# EAGLE design TRC_power1.0.0 (EAGLE 9.6.2)
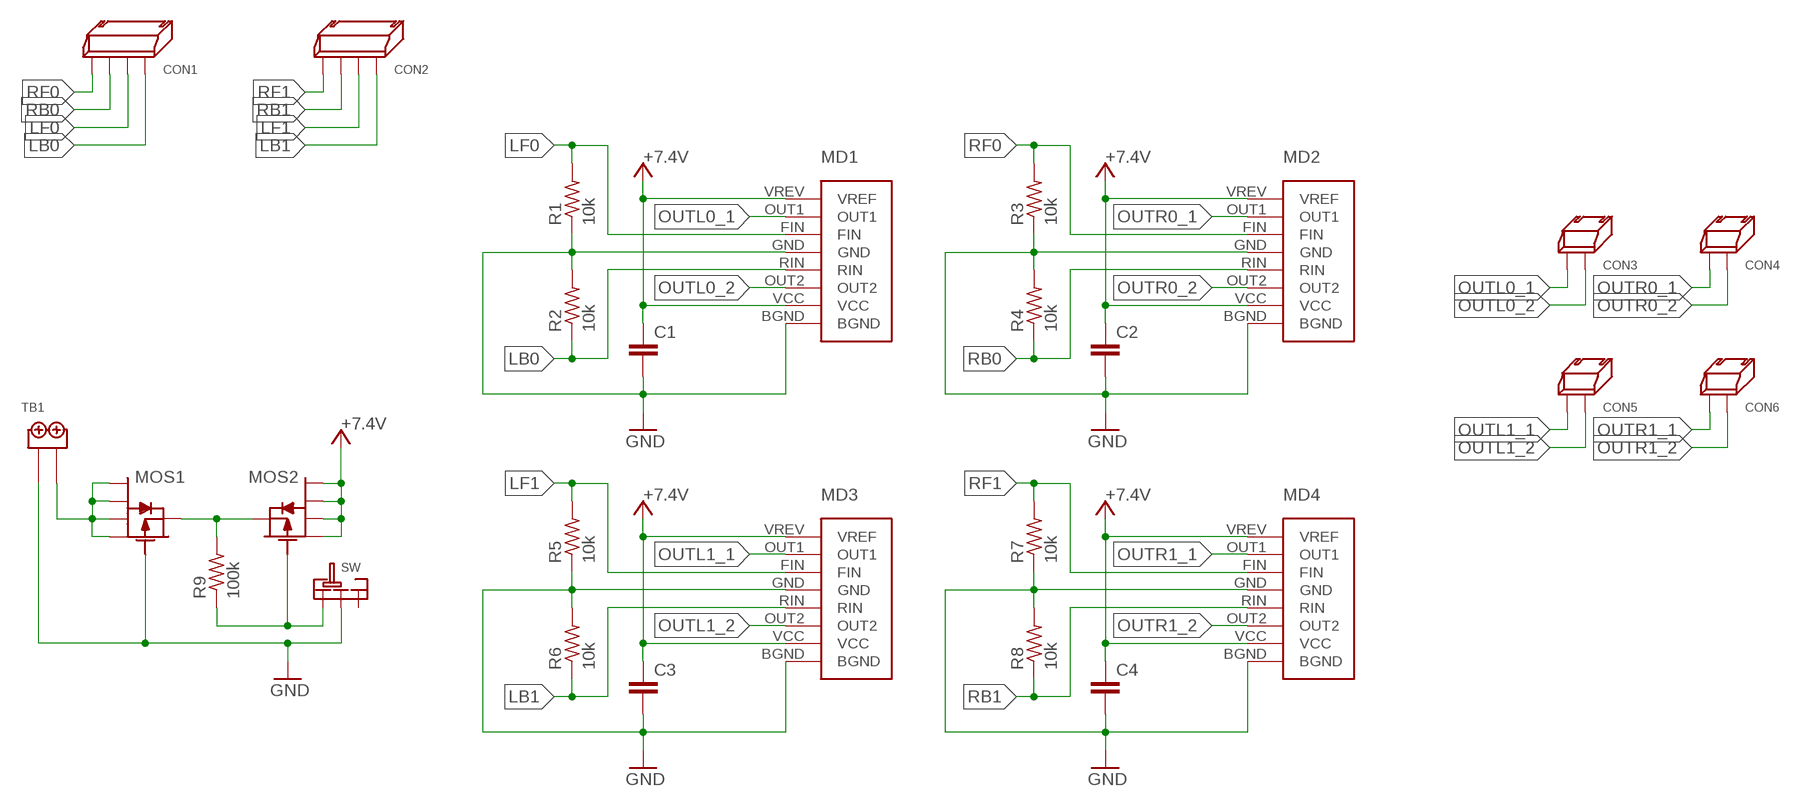
[diagram p0: schematic, sheet 1]

## Parts
C1  C-EUC0603  [C0603]
C2  C-EUC0603  [C0603]
C3  C-EUC0603  [C0603]
C4  C-EUC0603  [C0603]
CON1  4PIN_SIDE  [4PIN_SIDE]
CON2  4PIN_SIDE  [4PIN_SIDE]
CON3  2PIN_SIDE  [2PIN_SIDE]
CON4  2PIN_SIDE  [2PIN_SIDE]
CON5  2PIN_SIDE  [2PIN_SIDE]
CON6  2PIN_SIDE  [2PIN_SIDE]
MD1  BD6222HFP-TR  [BD6222HFP-TR]
MD2  BD6222HFP-TR  [BD6222HFP-TR]
MD3  BD6222HFP-TR  [BD6222HFP-TR]
MD4  BD6222HFP-TR  [BD6222HFP-TR]
MOS1  PCH_SSM6J808R  [SSM6J808R]
MOS2  PCH_SSM6J808R  [SSM6J808R]
R1  10k  R-US_R0603  [R0603]
R2  10k  R-US_R0603  [R0603]
R3  10k  R-US_R0603  [R0603]
R4  10k  R-US_R0603  [R0603]
R5  10k  R-US_R0603  [R0603]
R6  10k  R-US_R0603  [R0603]
R7  10k  R-US_R0603  [R0603]
R8  10k  R-US_R0603  [R0603]
R9  100k  R-US_R0603  [R0603]
SW  SRIDE_SWITCH  [SRIDE_SWITCH]
TB1  2PIN  [2PIN]

## Nets
+7.4V: C1.1 C2.1 C3.1 C4.1 MD1.VCC MD1.VREV(VREF) MD2.VCC MD2.VREV(VREF) MD3.VCC MD3.VREV(VREF) MD4.VCC MD4.VREV(VREF) MOS2.1 MOS2.2 MOS2.5 MOS2.6
GND: C1.2 C2.2 C3.2 C4.2 MD1.BGND MD1.GND MD2.BGND MD2.GND MD3.BGND MD3.GND MD4.BGND MD4.GND MOS1.3 R1.1 R2.2 R3.1 R4.2 R5.1 R6.2 R7.1 R8.2 SW.LR TB1.P$1
LB0: CON1.P$4 MD1.RIN R2.1
LB1: CON2.P$4 MD3.RIN R6.1
LF0: CON1.P$3 MD1.FIN R1.2
LF1: CON2.P$3 MD3.FIN R5.2
N$6: MOS1.4 MOS2.4 R9.2
N$7: MOS2.3 R9.1 SW.L
N$8: MOS1.1 MOS1.2 MOS1.5 MOS1.6 TB1.P$2
OUTL0_1: CON3.P$2 MD1.OUT1
OUTL0_2: CON3.P$1 MD1.OUT2
OUTL1_1: CON5.P$2 MD3.OUT1
OUTL1_2: CON5.P$1 MD3.OUT2
OUTR0_1: CON4.P$2 MD2.OUT1
OUTR0_2: CON4.P$1 MD2.OUT2
OUTR1_1: CON6.P$2 MD4.OUT1
OUTR1_2: CON6.P$1 MD4.OUT2
RB0: CON1.P$1 MD2.RIN R4.1
RB1: CON2.P$1 MD4.RIN R8.1
RF0: CON1.P$2 MD2.FIN R3.2
RF1: CON2.P$2 MD4.FIN R7.2
Unconnected: SW.R

## Library data of the parts
C1-C4 = rcl:C-EU: CAPACITOR, European symbol; SPICEPREFIX: C
CON1 CON2 = XR Connector:4PIN_SIDE
CON3-CON6 = XR Connector:2PIN_SIDE
MD1-MD4 = BD6222HFP-TR:BD6222HFP-TR
MOS1 MOS2 = Chip MOSFET:PCH_SSM6J808R
R1-R9 = rcl:R-US_: RESISTOR, American symbol; SPICEPREFIX: R
SW = Sride Switch:SRIDE_SWITCH
TB1 = TB113-2B-x-x-0-x-x:2PIN

## Board
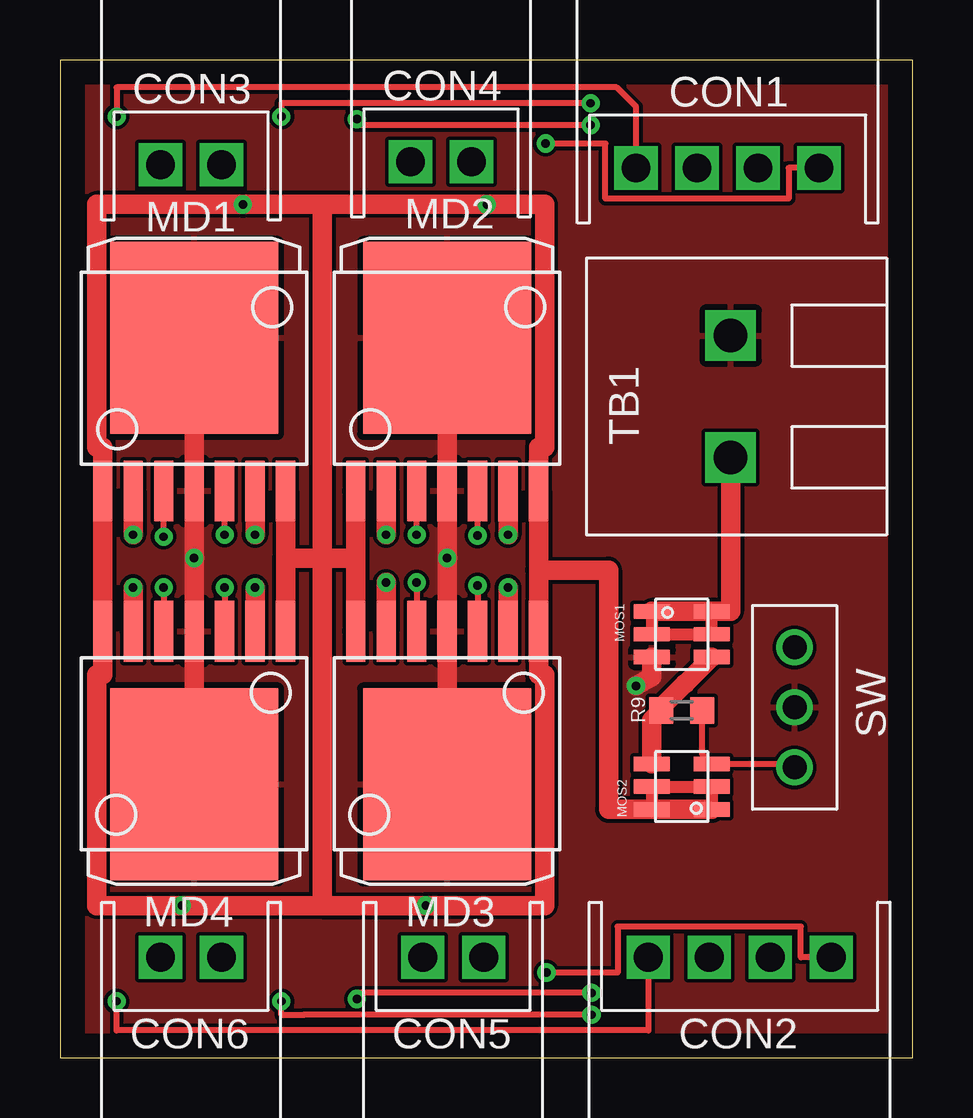
[diagram p1: board, top side]
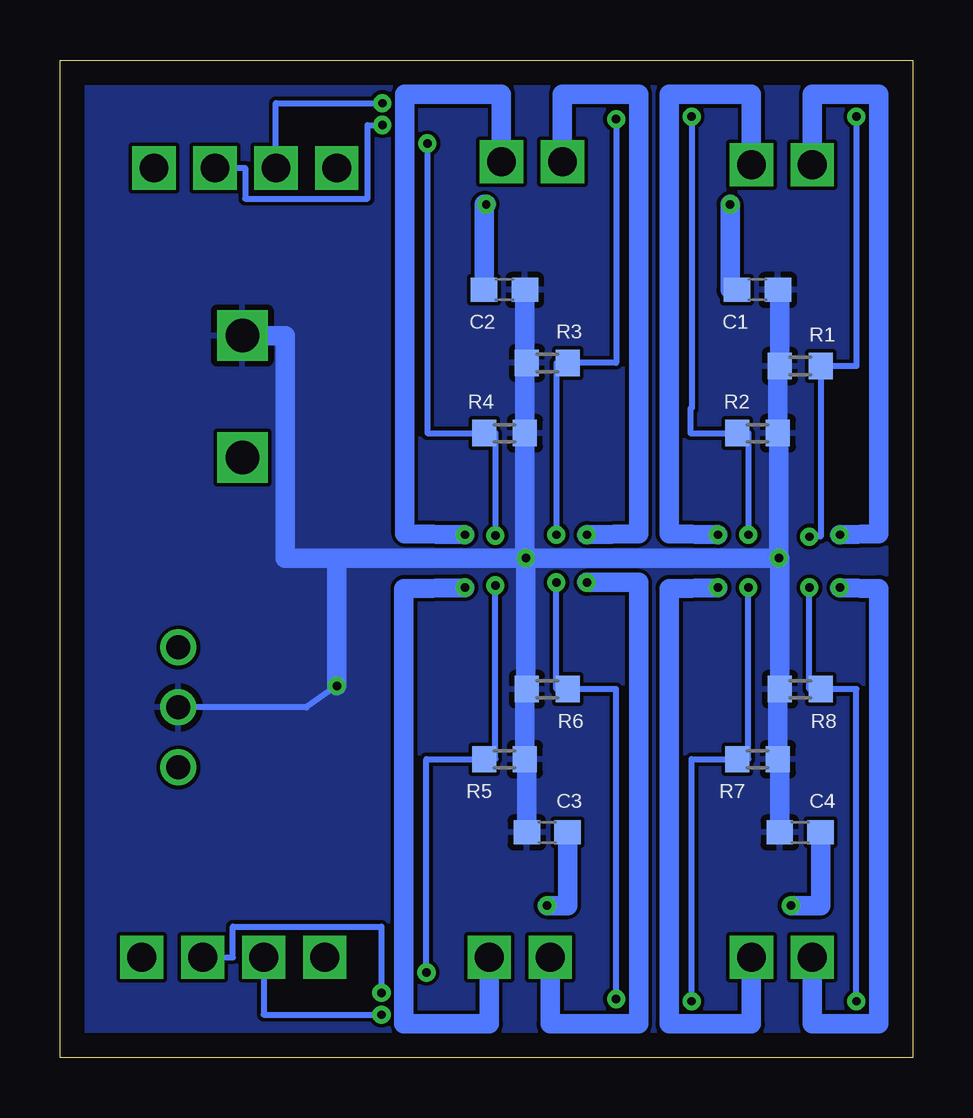
[diagram p2: board, bottom side, seen from below]

Size 35.54 x 41.58 mm. Coordinates in mm from the lower left corner, seen from the top.
Outline: 0,0 35.54,0 35.54,41.58 0,41.58 0,0
Copper layers (1*16): Top 0.035mm / dielectric 1.5mm / Bottom 0.035mm
Design rules "default": minimum track width 6mil, minimum drill 0.35mm, track to track 6mil, track to pad 6mil, pad to pad 6mil, via to via 6mil, smd to smd 6mil, copper to edge 40mil, drill to drill 6mil, minimum pad ring 10mil, minimum via ring 8mil, stop-mask expansion 4mil, vias tented up to drill 0mil, thermal gap 10mil

### Footprints (pad centres in the part's own frame; a part is rotated, then mirrored left to right if it is on the bottom)
C0603 = smd 1.1 x 1: 1 -0.85,0; 2 0.85,0
4PIN_SIDE = drill 1.2 square: P$1 -3.81,0; P$2 -1.27,0; P$3 3.81,0; P$4 1.27,0
2PIN_SIDE = drill 1.2 square: P$1 -1.27,0; P$2 1.27,0
BD6222HFP-TR = smd 7 x 8: BGND 0,6.378 | smd 0.8 x 2.54: FIN -1.27,0; GND 0,0; OUT1 -2.54,0; OUT2 2.54,0; RIN 1.27,0; VCC 3.81,0; VREV -3.81,0
SSM6J808R = smd 0.6 x 1.5: 1 -0.95,-1.25; 2 0,-1.25; 3 0.95,-1.25; 4 0.95,1.25; 5 0,1.25; 6 -0.95,1.25
R0603 = smd 1 x 1.1: 1 -0.85,0; 2 0.85,0
SRIDE_SWITCH = drill 1: L -2.5,0; LR 0,0; R 2.5,0
2PIN = drill 1.4 square: P$1 -2.54,0; P$2 2.54,0

### Placement (x,y rotation side)
C1  6.48,32 0 bottom
C2  17.02,32 0 bottom
C3  15.24,9.4 180 bottom
C4  4.7,9.4 180 bottom
CON1  27.81,37.08 180 top
CON2  28.32,4.19 0 top
CON3  5.46,37.21 180 top
CON4  15.88,37.34 180 top
CON5  16.38,4.19 0 top
CON6  5.46,4.19 0 top
MD1  5.59,23.62 0 top
MD2  16.13,23.62 0 top
MD3  16.13,17.78 180 top
MD4  5.59,17.78 180 top
MOS1  25.91,17.65 270 top
MOS2  25.91,11.3 90 top
R1  4.7,28.83 0 bottom
R2  6.48,26.04 0 bottom
R3  15.24,28.96 0 bottom
R4  17.02,26.04 0 bottom
R5  17.02,12.45 180 bottom
R6  15.24,15.37 180 bottom
R7  6.48,12.45 180 bottom
R8  4.7,15.37 180 bottom
R9  25.91,14.48 180 top
SW  30.61,14.61 90 top
TB1  27.94,27.56 270 top

### Tracks (layer width: path | path; a pad name or v marks a point on that pad's centre or on a via)
+7.4V  (via drill 0.35)
  Top 0.508: MOS2.1 MOS2.2 MOS2.5 MOS2.6
  Top 0.813: MD1.VCC 9.4,20.83 | MD4.VREV 9.4,20.83 | MD2.VREV 12.32,20.83 | 12.32,20.83 MD3.VCC | 19.94,20.32 MD2.VCC 19.94,25.44 20.19,25.44 20.19,35.56 v17.78,35.56 10.92,35.56 | 19.94,20.32 MD3.VREV 19.94,15.96 20.19,15.96 20.19,6.35 v15.24,6.35 10.92,6.35 | 9.4,20.83 10.92,20.83 | 10.92,20.83 12.32,20.83 | MOS2.1 MOS2.6 22.86,10.35 22.86,20.32 19.94,20.32 | 10.92,35.56 10.92,20.83 | 10.92,20.83 10.92,6.35 | 10.92,35.56 v7.62,35.56 1.53,35.56 1.53,25.44 1.78,25.44 MD1.VREV MD4.VCC 1.78,15.96 1.53,15.96 1.53,6.35 v5.08,6.35 10.92,6.35
  Bottom 0.813: v17.78,35.56 17.87,35.56 C2.1 | v15.24,6.35 14.39,6.35 C3.1 | v7.62,35.56 7.62,32 C1.1 | v5.08,6.35 3.85,6.35 C4.1
GND  (via drill 0.35)
  Top 0.813: MOS1.3 24.66,15.88 v24,15.5 | MD3.BGND MD3.GND v16.13,20.83 MD2.GND MD2.BGND | MD1.BGND MD1.GND v5.59,20.83 MD4.GND MD4.BGND
  Bottom 0.254: v24,15.5 25.27,14.61 SW.LR
  Bottom 0.813: v16.13,20.83 24.13,20.83 | 24.13,20.83 26.16,20.83 26.16,30.1 TB1.P$1 | v16.13,20.83 v5.59,20.83 | v5.59,20.83 5.59,26.04 R2.2 5.63,28.83 R1.1 5.55,32 C1.2 | C2.2 16.17,28.96 | R3.1 16.17,28.96 | 16.17,28.96 R4.2 16.17,20.83 v16.13,20.83 | v16.13,20.83 16.13,15.37 | 16.13,15.37 R6.2 | 16.13,15.37 16.17,15.37 R5.1 16.09,12.45 C3.2 | C4.2 5.55,12.45 R7.1 5.63,15.37 R8.2 5.55,20.83 v5.59,20.83 | v24,15.5 24,20.7 24.13,20.83
  pour Top: -1.27,43.18 36.83,43.18 36.83,-1.27 -1.27,-1.27
  pour Bottom: -1.27,43.18 36.83,43.18 36.83,-1.27 -1.27,-1.27
LB0  (via drill 0.35)
  Top 0.254: v22.11,39.78 9.22,39.78 v9.22,39.22 | v6.86,21.8 MD1.RIN
  Bottom 0.254: CON1.P$4 26.54,39.78 v22.11,39.78 | v9.22,39.22 9.22,27.05 9.27,27.05 9.27,26.04 R2.1 6.86,26.04 v6.86,21.8
LB1  (via drill 0.35)
  Top 0.254: v22.15,2.71 12.37,2.71 v12.37,2.46 | v14.86,19.81 MD3.RIN
  Bottom 0.254: CON2.P$4 28.33,4.19 28.33,5.47 22.15,5.47 v22.15,2.71 | v12.37,2.46 12.37,15.37 R6.1 14.86,15.37 v14.86,19.81
LF0  (via drill 0.35)
  Top 0.254: CON1.P$3 24,39.62 23.19,40.44 2.36,40.44 v2.36,39.22 | v4.32,21.72 MD1.FIN
  Bottom 0.254: v2.36,39.22 2.36,28.83 R1.2 3.85,21.72 v4.32,21.72
LF1  (via drill 0.35)
  Top 0.254: v20.27,3.56 23.23,3.56 23.23,5.47 30.87,5.47 30.87,4.19 CON2.P$3 | v17.4,19.68 MD3.FIN
  Bottom 0.254: v20.27,3.56 20.27,12.45 R5.2 17.4,12.45 v17.4,19.68
N$6
  Top 0.813: MOS1.4 26.04,15.59 26.03,15.59 25.06,14.62 R9.2 24.66,14.08 MOS2.4
N$7
  Top 0.254: SW.L 30.46,12.25 MOS2.3 26.76,12.65 R9.1
N$8
  Top 0.508: MOS1.1 MOS1.2 MOS1.5 MOS1.6
  Top 0.813: TB1.P$2 27.94,18.6 MOS1.6 MOS1.1
OUTL0_1  (via drill 0.35)
  Top 0.813: MD1.OUT1 v3.05,21.8
  Bottom 0.813: v3.05,21.8 1.42,21.84 1.42,40.16 4.19,40.16 CON3.P$2
OUTL0_2  (via drill 0.35)
  Top 0.813: MD1.OUT2 v8.13,21.8
  Bottom 0.813: v8.13,21.8 10.16,21.84 10.16,40.16 6.73,40.16 CON3.P$1
OUTL1_1  (via drill 0.35)
  Top 0.813: MD3.OUT1 v18.67,19.6
  Bottom 0.813: v18.67,19.6 21.21,19.56 21.21,1.42 17.65,1.42 CON5.P$2
OUTL1_2  (via drill 0.35)
  Top 0.813: v13.59,19.81 MD3.OUT2
  Bottom 0.813: CON5.P$1 15.11,1.42 11.43,1.42 11.43,19.81 v13.59,19.81
OUTR0_1  (via drill 0.35)
  Top 0.813: MD2.OUT1 v13.59,21.8
  Bottom 0.813: v13.59,21.8 11.43,21.84 11.43,40.16 14.61,40.16 CON4.P$2
OUTR0_2  (via drill 0.35)
  Top 0.813: MD2.OUT2 v18.67,21.8
  Bottom 0.813: v18.67,21.8 21.17,21.84 21.17,40.16 17.14,40.16 CON4.P$1
OUTR1_1  (via drill 0.35)
  Top 0.813: MD4.OUT1 v8.13,19.6
  Bottom 0.813: v8.13,19.6 10.16,19.56 10.16,1.42 6.73,1.42 CON6.P$2
OUTR1_2  (via drill 0.35)
  Top 0.813: MD4.OUT2 v3.05,19.6
  Bottom 0.813: v3.05,19.6 1.42,19.56 1.42,1.42 4.19,1.42 CON6.P$1
RB0  (via drill 0.35)
  Top 0.254: v20.24,38.1 22.72,38.1 22.72,35.8 30.36,35.8 30.36,37.08 CON1.P$1 | v17.4,21.77 MD2.RIN
  Bottom 0.254: v20.24,38.1 20.24,26.04 R4.1 17.4,26.04 v17.4,21.77
RB1  (via drill 0.35)
  Top 0.254: CON2.P$1 24.51,1.14 2.36,1.14 v2.36,2.36 | v4.32,19.6 MD4.RIN
  Bottom 0.254: v2.36,2.36 2.36,15.37 R8.1 4.32,15.37 v4.32,19.6
RF0  (via drill 0.35)
  Top 0.254: v22.11,38.87 12.37,38.87 v12.37,39.12 | v14.86,21.8 MD2.FIN
  Bottom 0.254: v22.11,38.87 22.72,38.87 22.72,35.8 27.82,35.8 27.82,37.08 CON1.P$2 | v12.37,39.12 12.37,28.96 R3.2 14.86,28.96 v14.86,21.8
RF1  (via drill 0.35)
  Top 0.254: v22.15,1.8 10.16,1.8 10.16,1.78 9.22,1.78 v9.22,2.36 | v6.86,19.6 MD4.FIN
  Bottom 0.254: CON2.P$2 27.05,1.8 v22.15,1.8 | v9.22,2.36 9.22,12.45 R7.2 6.86,12.45 v6.86,19.6